# Altium schematic sheet 14-misc.SchDoc: Miscellaneous
size Letter; DrawnBy: J. Brinton; Engineer: J. Brinton; Revision: 1; SheetNumber: 14; SheetTotal: 14
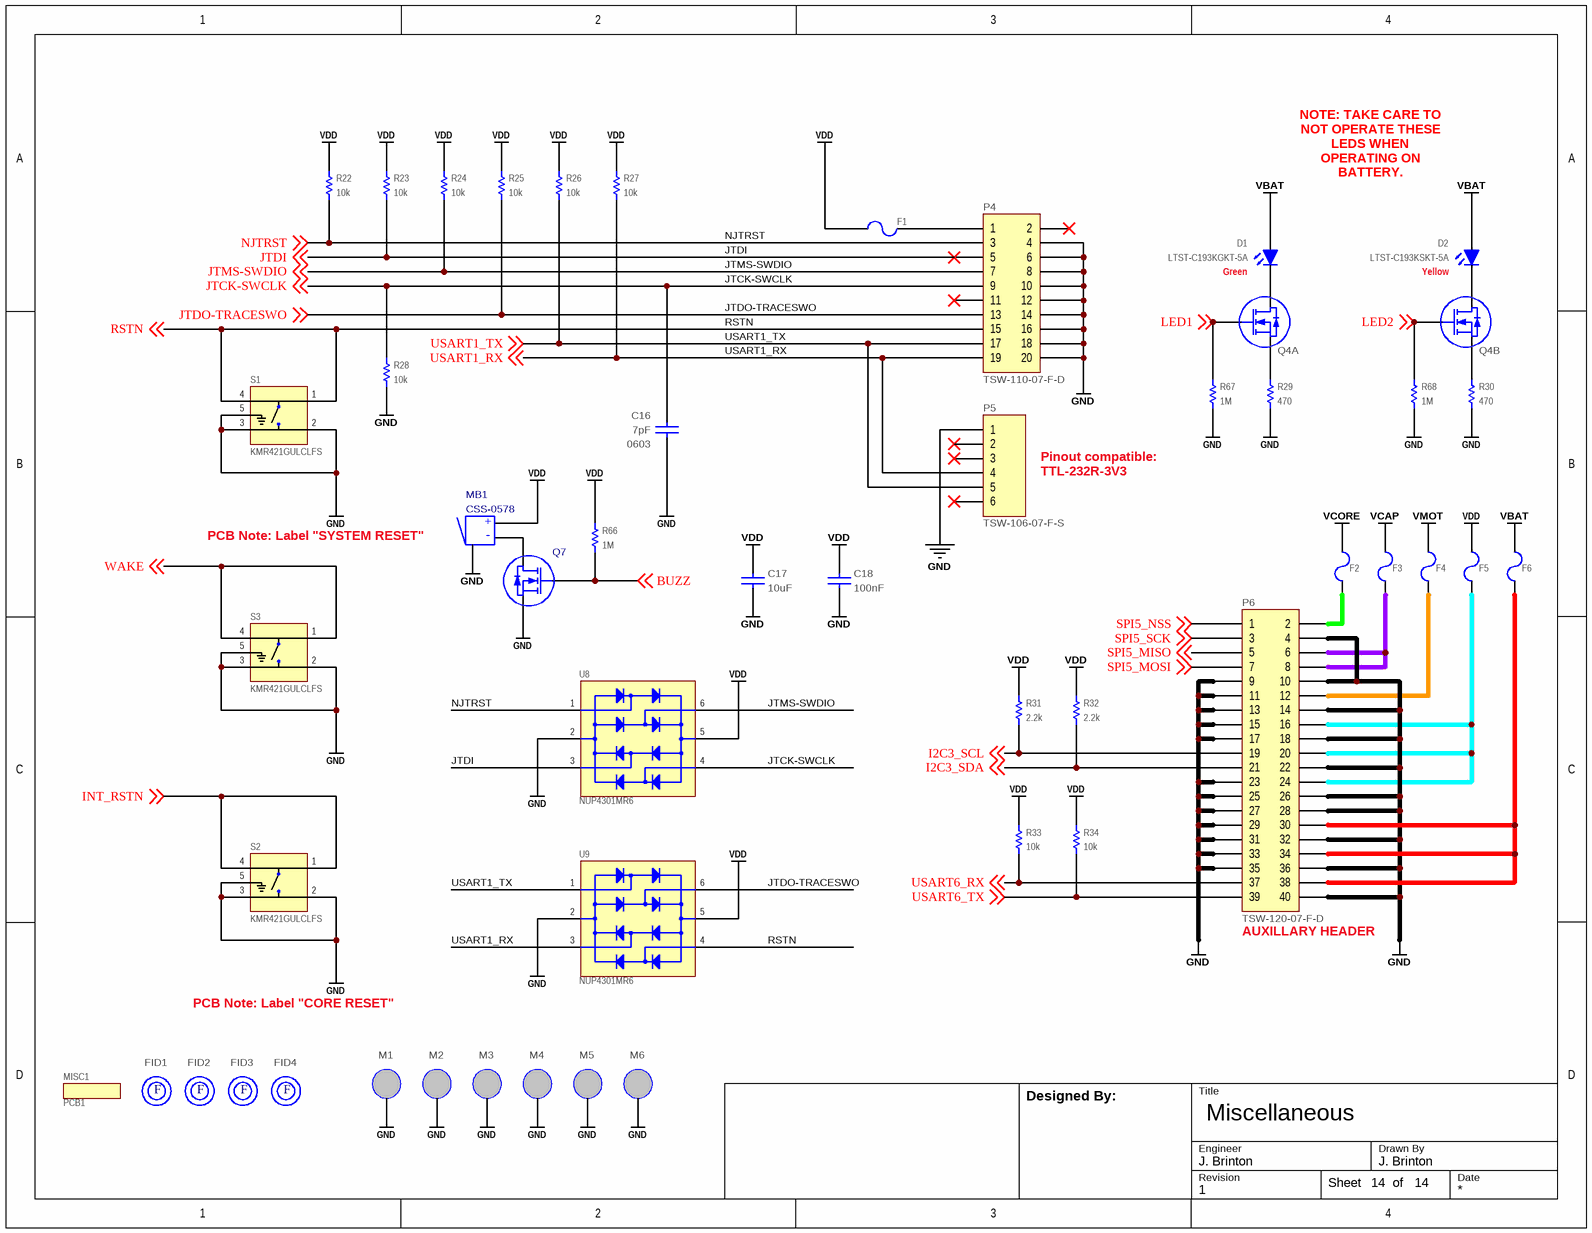
[diagram p0: 14-misc.SchDoc]

## Parts
C16  value 7pF  Package: 0603  [CAPC160X80X90L20N]  (hidden comment: CL10C070CB8NNNC)
C17  value 10uF  [CAPC200X125X145L45N]  (hidden comment: CL21B106KOQNNNE)
C18  value 100nF  [CAPC200X125X145L45N]  (hidden comment: GCM21BR71H104KA37L)
D1  LTST-C193KGKT-5A  [0603_LED]
D2  LTST-C193KSKT-5A  [0603_LED]
F1  0ZCJ0020FF2E  [1206]  (value not drawn)
F2  0ZCJ0020FF2E  [1206]  (value not drawn)
F3  0ZCJ0020FF2E  [1206]  (value not drawn)
F4  0ZCJ0020FF2E  [1206]  (value not drawn)
F5  0ZCJ0020FF2E  [1206]  (value not drawn)
F6  0ZCJ0020FF2E  [1206]  (value not drawn)
FID1  FIDUCIAL  [fiducial1mm]  (value not drawn)  (no BOM)
FID2  FIDUCIAL  [fiducial1mm]  (value not drawn)  (no BOM)
FID3  FIDUCIAL  [fiducial1mm]  (value not drawn)  (no BOM)
FID4  FIDUCIAL  [fiducial1mm]  (value not drawn)  (no BOM)
M1  MOUNT  [M4_MOUNT]  (value not drawn)  (no BOM)
M2  MOUNT  [M4_MOUNT]  (value not drawn)  (no BOM)
M3  MOUNT  [M4_MOUNT]  (value not drawn)  (no BOM)
M4  MOUNT  [M4_MOUNT]  (value not drawn)  (no BOM)
M5  MOUNT  [M4_MOUNT]  (value not drawn)  (no BOM)
M6  MOUNT  [M4_MOUNT]  (value not drawn)  (no BOM)
MB1  CSS-0578  [CSS-0578]
MISC1  PCB1
P4  TSW-110-07-F-D  [TSW-110-07-F-D]
P5  TSW-106-07-F-S  [TSW-106-07-F-S]
P6  TSW-120-07-F-D  [TSW-120-07-F-D]
Q4  UM6K34NTCN  [SOT363]  (value not drawn)  (parts A,B of 2)
Q7  2N7002W-7-F  [SOT323]  (value not drawn)
R22  value 10k  [RESC2012X70N]  (hidden comment: ERA-6AEB103V)
R23  value 10k  [RESC2012X70N]  (hidden comment: ERA-6AEB103V)
R24  value 10k  [RESC2012X70N]  (hidden comment: ERA-6AEB103V)
R25  value 10k  [RESC2012X70N]  (hidden comment: ERA-6AEB103V)
R26  value 10k  [RESC2012X70N]  (hidden comment: ERA-6AEB103V)
R27  value 10k  [RESC2012X70N]  (hidden comment: ERA-6AEB103V)
R28  value 10k  [RESC2012X70N]  (hidden comment: ERA-6AEB103V)
R29  value 470  [RESC2012X70N]  (hidden comment: ERJ-6ENF4700V)
R30  value 470  [RESC2012X70N]  (hidden comment: ERJ-6ENF4700V)
R31  value 2.2k  [RESC2012X70N]  (hidden comment: ERA-6AEB222V)
R32  value 2.2k  [RESC2012X70N]  (hidden comment: ERA-6AEB222V)
R33  value 10k  [RESC2012X70N]  (hidden comment: ERA-6AEB103V)
R34  value 10k  [RESC2012X70N]  (hidden comment: ERA-6AEB103V)
R66  value 1M  [RESC2012X70N]  (hidden comment: ERJ-6ENF1004V)
R67  value 1M  [RESC2012X70N]  (hidden comment: ERJ-6ENF1004V)
R68  value 1M  [RESC2012X70N]  (hidden comment: ERJ-6ENF1004V)
S1  KMR421GULCLFS  [SW_KMR421GULCLFS]
S2  KMR421GULCLFS  [SW_KMR421GULCLFS]
S3  KMR421GULCLFS  [SW_KMR421GULCLFS]
U8  NUP4301MR6  [SOT23-6]
U9  NUP4301MR6  [SOT23-6]

## Nets
GND: C16.1 C17.2 C18.2 M1.1(MNT) M2.1(MNT) M3.1(MNT) M4.1(MNT) M5.1(MNT) M6.1(MNT) MB1.3(TAB) P4.4 P4.6 P4.8 P4.10 P4.12 P4.14 P4.16 P4.18 P4.20 P5.1 P6.4 P6.9 P6.10 P6.11 P6.13 P6.14 P6.15 P6.17 P6.18 P6.22 P6.23 P6.25 P6.26 P6.27 P6.28 P6.29 P6.31 P6.32 P6.33 P6.35 P6.36 P6.40 Q7.2(S) R28.1 R29.1 R30.1 R67.1 R68.1 S1.2 S1.3 S1.5(G) S2.2 S2.3 S2.5(G) S3.2 S3.3 S3.5(G) U8.2(VN) U9.2(VN)
VBAT: D1.1(A) D2.1(A) F6.1
VCAP: F3.1
VCORE: F2.1
VDD: C17.1 C18.1 F1.1 F5.1 MB1.1(POS) R22.2 R23.2 R24.2 R25.2 R26.2 R27.2 R31.2 R32.2 R33.2 R34.2 R66.2 U8.5(VP) U9.5(VP)
VMOT: F4.1
BUZZ: Q7.1(G) R66.1 ; off-sheet BUZZ
I2C3_SCL: P6.19 R31.1 ; off-sheet I2C3_SCL
I2C3_SDA: P6.21 R32.1 ; off-sheet I2C3_SDA
INT_RSTN: S2.1 S2.4 ; off-sheet INT_RSTN
JTCK-SWCLK: C16.2 P4.9 R28.2 U8.4(C) ; off-sheet JTCK-SWCLK
JTDI: P4.5 R23.1 U8.3(B) ; off-sheet JTDI
JTDO-TRACESWO: P4.13 R25.1 U9.6(D) ; off-sheet JTDO-TRACESWO
JTMS-SWDIO: P4.7 R24.1 U8.6(D) ; off-sheet JTMS-SWDIO
LED1: Q4.5(G1) R67.2 ; off-sheet LED1
LED2: Q4.2(G2) R68.2 ; off-sheet LED2
NJTRST: P4.3 R22.1 U8.1(A) ; off-sheet NJTRST
RSTN: P4.15 S1.1 S1.4 U9.4(C) ; off-sheet RSTN
SPI5_MISO: P6.5 ; off-sheet SPI5_MISO
SPI5_MOSI: P6.7 ; off-sheet SPI5_MOSI
SPI5_NSS: P6.1 ; off-sheet SPI5_NSS
SPI5_SCK: P6.3 ; off-sheet SPI5_SCK
USART1_RX: P4.19 P5.4 R27.1 U9.3(B) ; off-sheet USART1_RX
USART1_TX: P4.17 P5.5 R26.1 U9.1(A) ; off-sheet USART1_TX
USART6_RX: P6.37 R33.1 ; off-sheet USART6_RX
USART6_TX: P6.39 R34.1 ; off-sheet USART6_TX
WAKE: S3.1 S3.4 ; off-sheet WAKE
NetD1_2: D1.2(K) Q4.3(D1)
NetD2_2: D2.2(K) Q4.6(D2)
NetF1_2: F1.2 P4.1
NetF2_2: F2.2 P6.2
NetF3_2: F3.2 P6.6 P6.8
NetF4_2: F4.2 P6.12
NetF5_2: F5.2 P6.16 P6.20 P6.24
NetF6_2: F6.2 P6.30 P6.34 P6.38
NetMB1_2: MB1.2(NEG) Q7.3(D)
NetQ4_1: Q4.1(S2) R30.2
NetQ4_4: Q4.4(S1) R29.2

Not connected (* = marked no-connect by the designer): P4 2* 11*; P5 2* 3* 6*

## Notes on the sheet
- NOTE: TAKE CARE TO NOT OPERATE THESE LEDS WHEN OPERATING ON BATTERY.
- Green
- Yellow
- Pinout compatible:
- PCB Note: Label "SYSTEM RESET"
- TTL-232R-3V3
- (near P6) AUXILLARY HEADER
- PCB Note: Label "CORE RESET"
- Designed By:
- Title
- Engineer
- Revision
- Drawn By
- Date
- Sheet
- of
- (in symbol CSS-0578) +; -
- (in symbol FIDUCIAL) F

## Library data of the parts
C16 = CAP: Ceramic Capacitor 7pF +/-0.25pF 0603; Manufacturer: Samsung; Tr: -55:125; Voltage: 50V; Manufacturer P/N: CL10C070CB8NNNC; Tolerance: +/-0.25pF
C17 = LMK212B7106KG: Ceramic Capacitor 10uF ±10% 16V X7R 0805; Manufacturer: Samsung; Tr: -55:105; Manufacturer P/N: CL21B106KOQNNNE; Tolerance: ±10%; Package: 0805; Voltage: 16V
C18 = TMK212B7105KG: Ceramic Capacitor 100nF ±10% 50V X7R 0805; Manufacturer: Murata; Tr: -55:125; Manufacturer P/N: GCM21BR71H104KA37L; Tolerance: ±10%; Package: 0805; Voltage: 50V
D1 = LED0603Y: LED, SMT 0603, Color Green, 5mA, 2V; Manufacturer: Lite-On; Manufacturer P/N: LTST-C193KGKT-5A; Package: 0603 Polarized
D2 = LED0603Y: LED, SMT 0603, Color Yellow, 5mA, 2.9V; Manufacturer: Panasonic; Manufacturer P/N: LTST-C193KSKT-5A; Package: 0603 Polarized
F1-F6 = 0ZCJ0020FF2E: PTC Resettable Fuse, 0.2A, 30V, SMD 1206; Manufacturer: Bell Fuse; Manufacturer P/N: 0ZCJ0020FF2E; Package: 1206
MB1 = CSS-0578: Magnetic Buzzer; Manufacturer: CUI, Inc.; Manufacturer P/N: CSS-0578
MISC1 = MISC: Printed Circuit Board; Manufacturer: Aware; Manufacturer P/N: PCB1
P4 = Header 10X2: Header, 10-Pin, Dual row; Manufacturer: Samtec; Manufacturer P/N: TSW-110-07-F-D
P5 = Header 6: Header, 6-Pin; Manufacturer: Samtec; Manufacturer P/N: TSW-106-07-F-S
P6 = Header 20X2: Header, 20-Pin, Dual row; Manufacturer: Samtec; Manufacturer P/N: TSW-120-07-F-D
Q4 = 2N7002DW-7-F: Dual N-Channel Enhancement Mode MOSFET; Manufacturer: Rohm; Tr: -55:150; Manufacturer P/N: UM6K34NTCN; Package: SOT363
Q7 = 2N7002-7-F: N-Channel Enhancement Mode MOSFET; Manufacturer: Diodes, Inc.; Tr: -55:150; Manufacturer P/N: 2N7002W-7-F; Package: SOT363
R22-R28 R33 R34 = RES: Thin Film Resistor 10k ±0.1% 0.125W 100V 0805; Manufacturer: Panasonic; Tcr: ±25; Tr: -55:155; Voltage: 100; Power: 0.125; Tolerance: ±0.1%; Manufacturer P/N: ERA-6AEB103V; Package: 0805
R29 R30 = RES 0402: Thick Film Resistor 470 ±1% 0805; Manufacturer: Panasonic; Tr: -55:155; Package: 0805; Manufacturer P/N: ERJ-6ENF4700V; Tolerance: ±1%
R31 R32 = RES: Thin Film Resistor 2.2k ±0.1% 0.125W 100V 0805; Manufacturer: Panasonic; Tcr: ±25; Tr: -55:155; Voltage: 100; Power: 0.125; Tolerance: ±0.1%; Manufacturer P/N: ERA-6AEB222V; Package: 0805
R66-R68 = RES 0402: Thick Film Resistor 1M ±1% 0805; Manufacturer: Panasonic; Tr: -55:155; Package: 0805; Manufacturer P/N: ERJ-6ENF1004V; Tolerance: ±1%
S1-S3 = KMR421GULCLFS: Switch Tactile N.O. SPST Round Button Gull Wing 0.05A 32VDC 1VA; Manufacturer: C&K Components; Availability: Good; Package: None; Manufacturer P/N: KMR421GULCLFS; Price: 0.29 USD; Value: *
U8 U9 = NUP4301MR6: 4-Lane TVS Diode Array; Manufacturer: On Semiconductor; Manufacturer P/N: NUP4301MR6
M1-M6 = MOUNT: Manufacturer: *; Manufacturer P/N: *